# EAGLE design Group_01 (EAGLE 9.6.2)

## Sheet 1 of 2
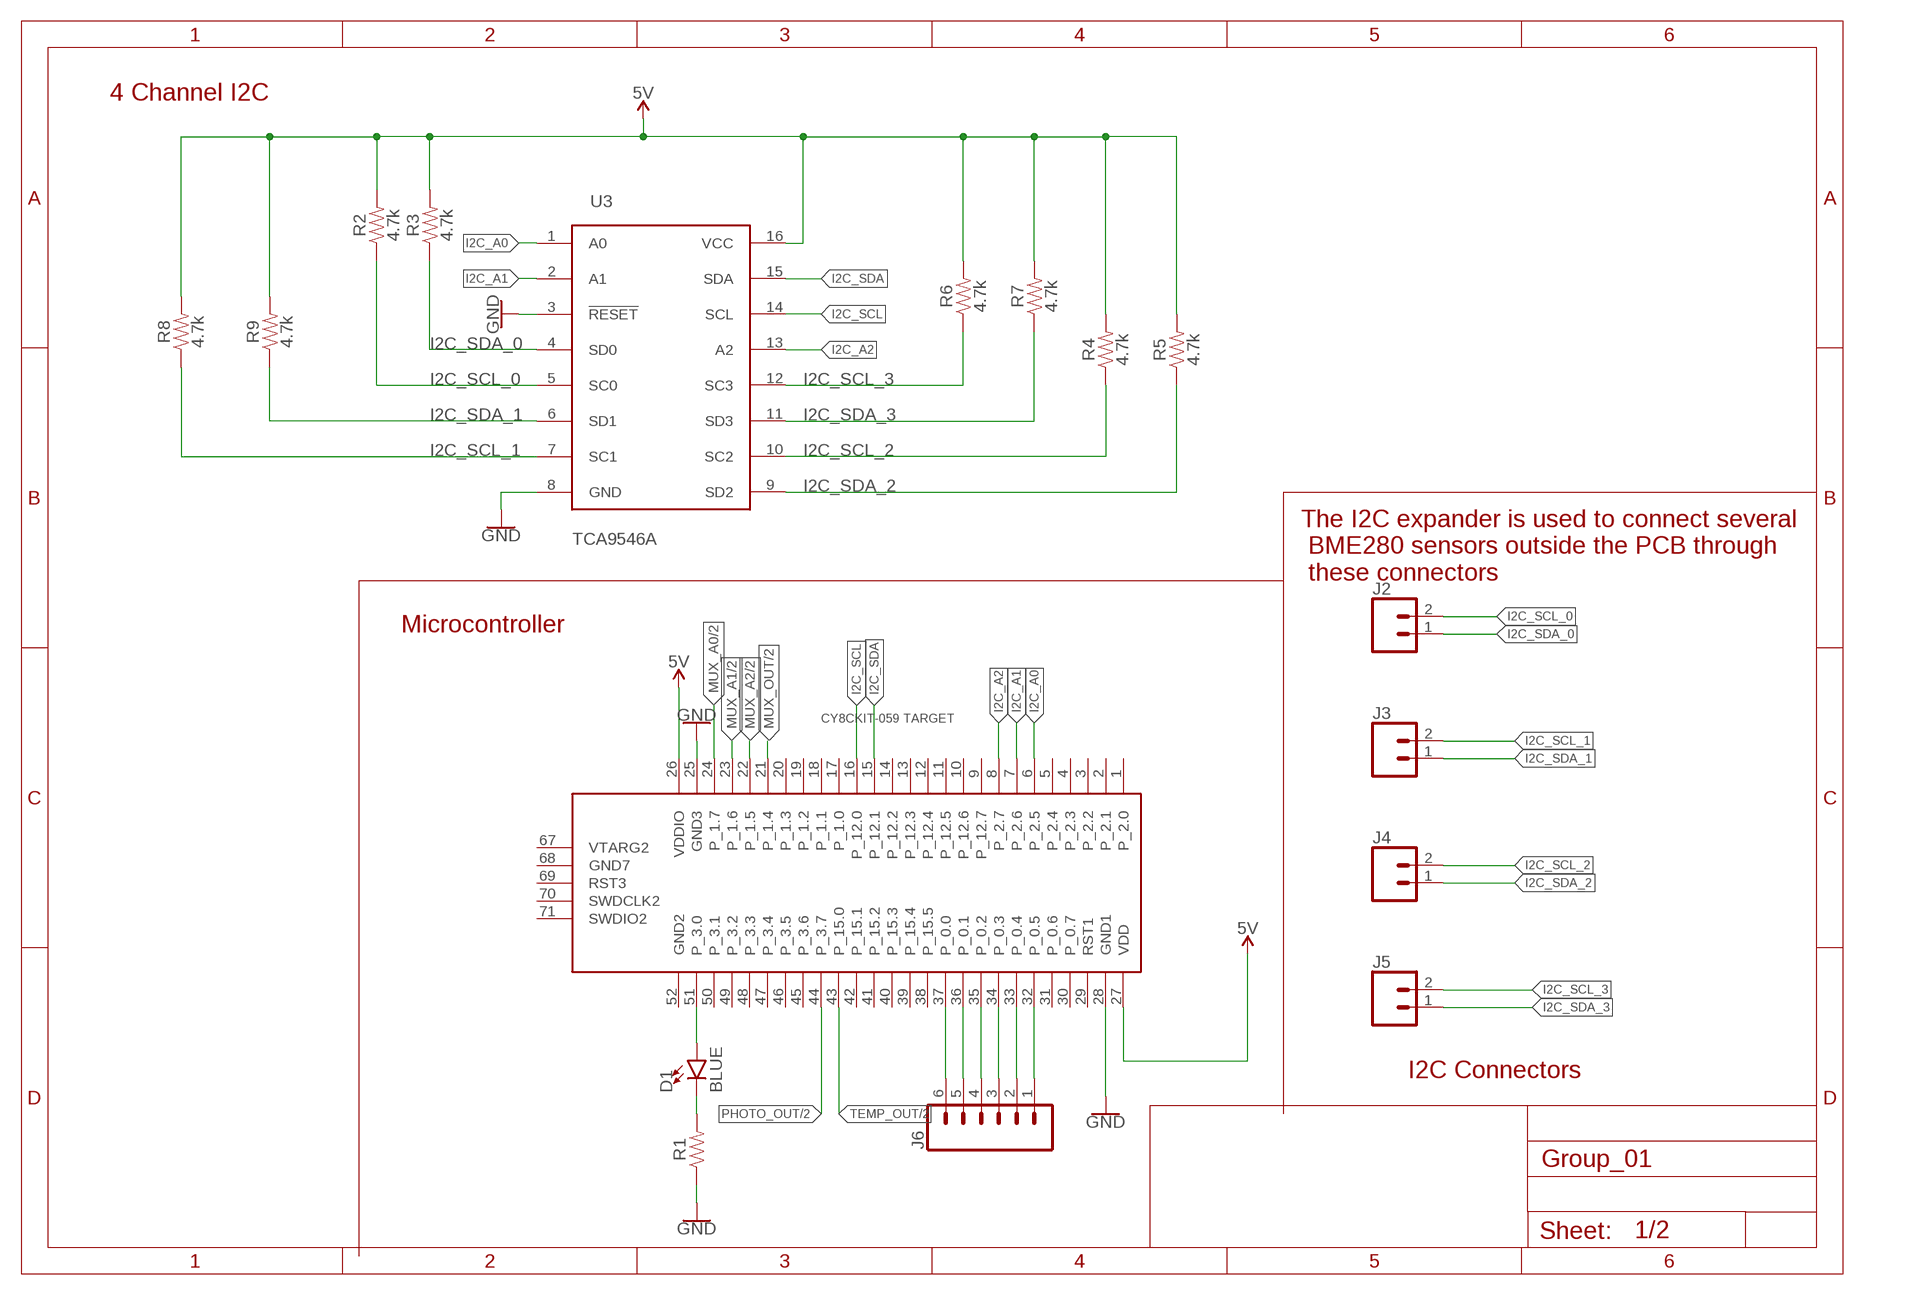
[diagram p0: schematic, sheet 1]

### Parts
D1  BLUE  LED-BLUE1206  [LED-1206]
J2  CONN_02  [1X02]
J3  CONN_02  [1X02]
J4  CONN_02  [1X02]
J5  CONN_02  [1X02]
J6  CONN_06LOCK  [1X06_LOCK]
R1  RESISTORAXIAL-0.3  [AXIAL-0.3]
R2  4.7k  4.7KOHM-0603-1/10W-1%  [0603]
R3  4.7k  4.7KOHM-0603-1/10W-1%  [0603]
R4  4.7k  4.7KOHM-0603-1/10W-1%  [0603]
R5  4.7k  4.7KOHM-0603-1/10W-1%  [0603]
R6  4.7k  4.7KOHM-0603-1/10W-1%  [0603]
R7  4.7k  4.7KOHM-0603-1/10W-1%  [0603]
R8  4.7k  4.7KOHM-0603-1/10W-1%  [0603]
R9  4.7k  4.7KOHM-0603-1/10W-1%  [0603]
U3  TCA9546A  [TSSOP16]
U$2  CY8CKIT-059_TARGET  [CY8CKIT-059_TARGET]

### Nets
5V: R2.2 R3.2 R4.2 R5.2 R6.2 R7.2 R8.2 R9.2 U3.16(VCC) U$2.26(VDDIO) U$2.27(VDD) ; also sheet 2
GND: R1.P$1 U3.3(!RESET!) U3.8(GND) U$2.25(GND3) U$2.28(GND1) ; also sheet 2
I2C_A0: U3.1(A0) U$2.6(P_2.5)
I2C_A1: U3.2(A1) U$2.7(P_2.6)
I2C_A2: U3.13(A2) U$2.8(P_2.7)
I2C_SCL: U3.14(SCL) U$2.16(P_12.0)
I2C_SCL_0: J2.2 R2.1 U3.5(SC0)
I2C_SCL_1: J3.2 R8.1 U3.7(SC1)
I2C_SCL_2: J4.2 R4.1 U3.10(SC2)
I2C_SCL_3: J5.2 R6.1 U3.12(SC3)
I2C_SDA: U3.15(SDA) U$2.15(P_12.1)
I2C_SDA_0: J2.1 R3.1 U3.4(SD0)
I2C_SDA_1: J3.1 R9.1 U3.6(SD1)
I2C_SDA_2: J4.1 R5.1 U3.9(SD2)
I2C_SDA_3: J5.1 R7.1 U3.11(SD3)
MUX_A0: U$2.24(P_1.7) ; also sheet 2
MUX_A1: U$2.23(P_1.6) ; also sheet 2
MUX_A2: U$2.22(P_1.5) ; also sheet 2
MUX_OUT: U$2.21(P_1.4) ; also sheet 2
N$8: D1.A U$2.51(P_3.0)
N$9: D1.C R1.P$2
P_0.0: J6.6 U$2.37(P_0.0)
P_0.1: J6.5 U$2.36(P_0.1)
P_0.2: J6.4 U$2.35(P_0.2)
P_0.3: J6.3 U$2.34(P_0.3)
P_0.4: J6.2 U$2.33(P_0.4)
P_0.5: J6.1 U$2.32(P_0.5)
PHOTO_OUT: U$2.44(P_3.7) ; also sheet 2
TEMP_OUT: U$2.43(P_15.0) ; also sheet 2
Unconnected: U$2.1(P_2.0) U$2.2(P_2.1) U$2.3(P_2.2) U$2.4(P_2.3) U$2.5(P_2.4) U$2.9(P_12.7) U$2.10(P_12.6) U$2.11(P_12.5) U$2.12(P_12.4) U$2.13(P_12.3) U$2.14(P_12.2) U$2.17(P_1.0) U$2.18(P_1.1) U$2.19(P_1.2) U$2.20(P_1.3) U$2.29(RST1) U$2.30(P_0.7) U$2.31(P_0.6) U$2.38(P_15.5) U$2.39(P_15.4) U$2.40(P_15.3) U$2.41(P_15.2) U$2.42(P_15.1) U$2.45(P_3.6) U$2.46(P_3.5) U$2.47(P_3.4) U$2.48(P_3.3) U$2.49(P_3.2) U$2.50(P_3.1) U$2.52(GND2) U$2.67(VTARG2) U$2.68(GND7) U$2.69(RST3) U$2.70(SWDCLK2) U$2.71(SWDIO2)

### Notes on the sheet
- 4 Channel I2C
- The I2C expander is used to connect several
   BME280 sensors outside the PCB through
   these connectors
- Microcontroller
- I2C Connectors

## Sheet 2 of 2
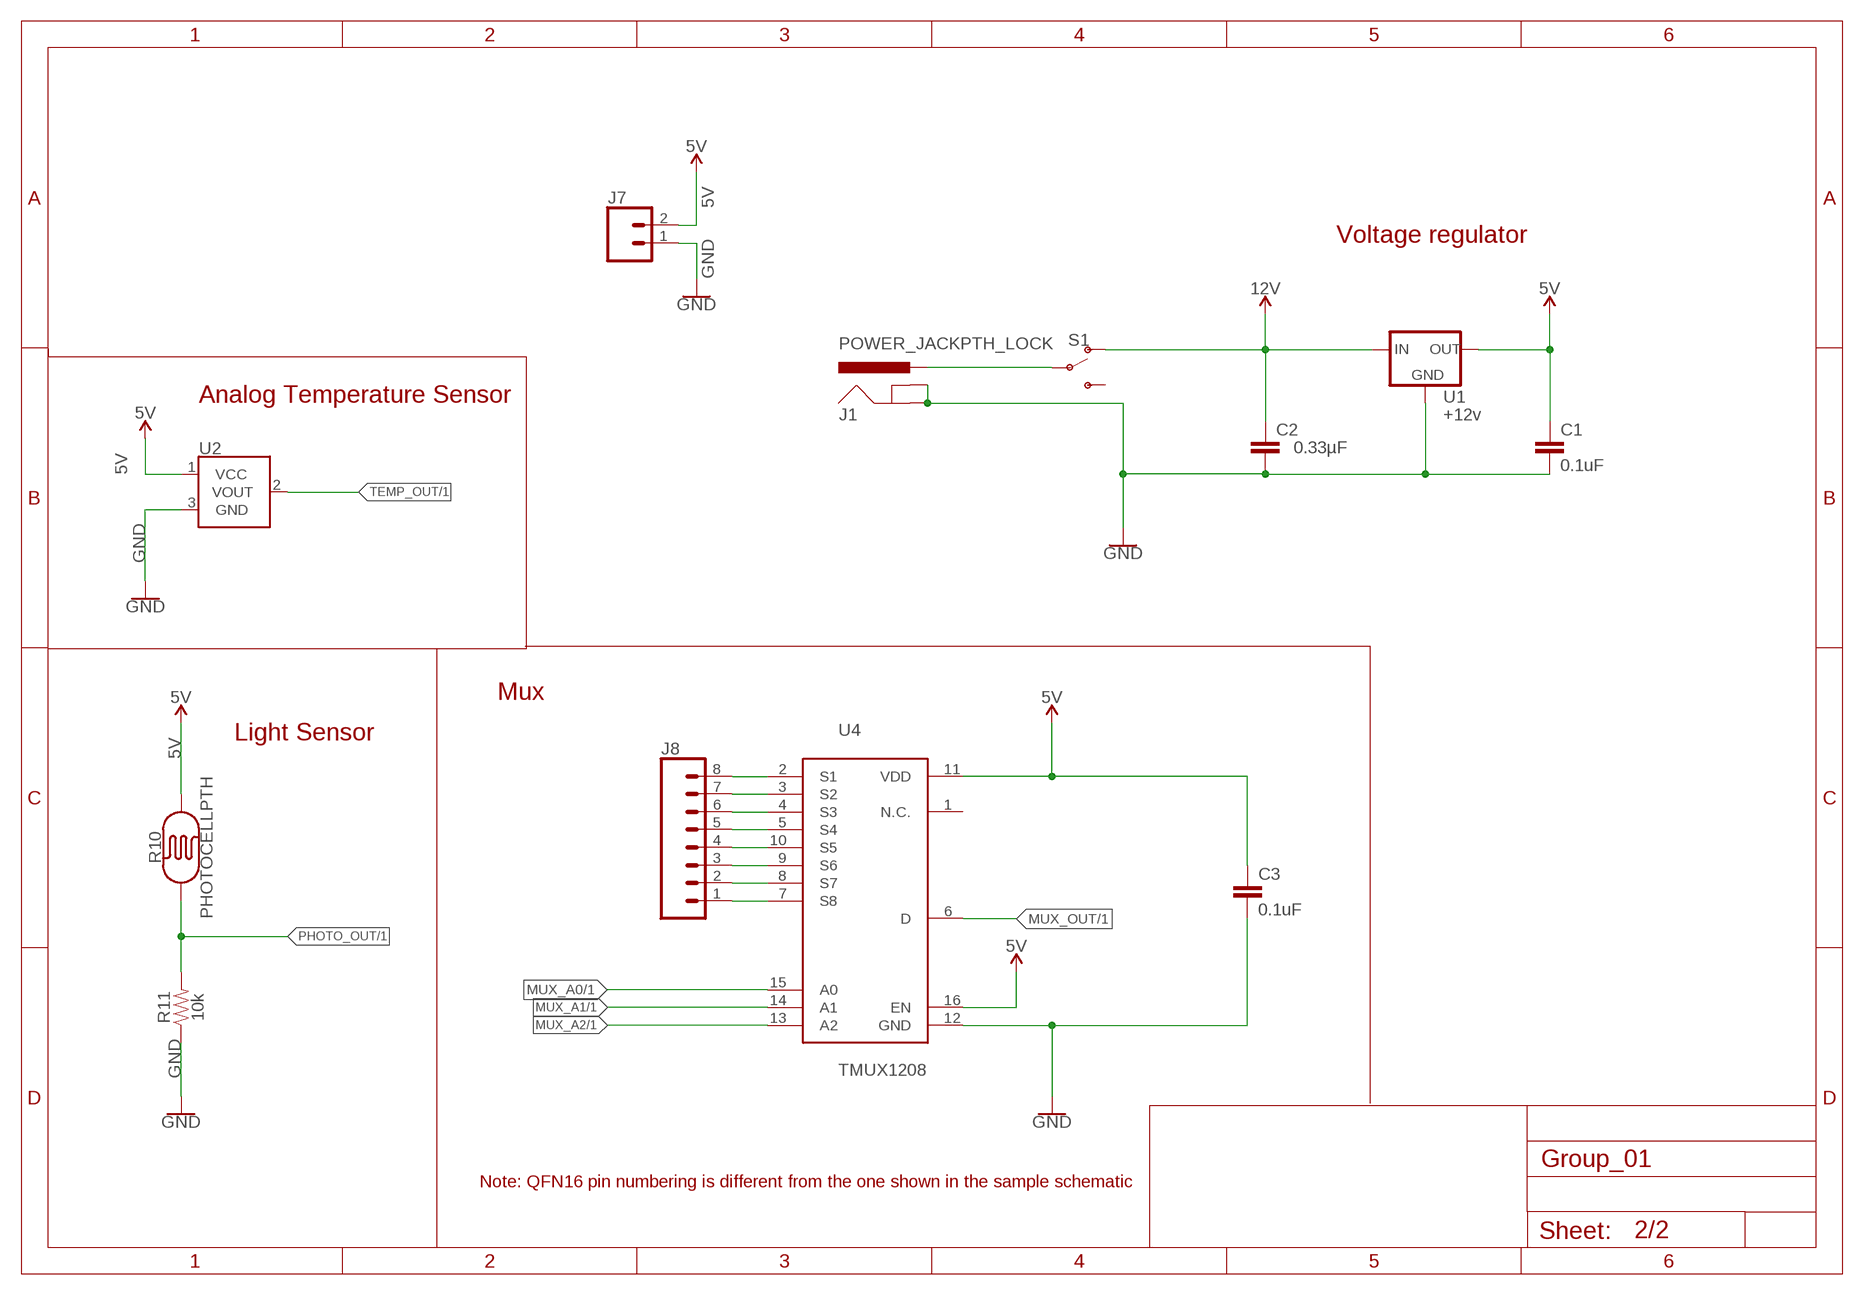
[diagram p1: schematic, sheet 2]

### Parts
C1  0.1uF  0.1UF-KIT-EZ-50V-20%  [CAP-PTH-SMALL-KIT]
C2  0.33µF  0.33UF/330NF-0805-50V-10%  [0805]
C3  0.1uF  0.1UF-KIT-EZ-50V-20%  [CAP-PTH-SMALL-KIT]
J1  POWER_JACKPTH_LOCK  [POWER_JACK_PTH_LOCK]
J7  CONN_02  [1X02]
J8  CONN_08LOCK  [1X08_LOCK]
R10  PHOTOCELLPTH  [PHOTOCELL]
R11  10k  10KOHM-0603-1/10W-1%  [0603]
S1  SWITCH-SPDT-PTH-11.6X4.0MM  [SWITCH_SPDT_PTH_11.6X4.0MM]
U1  +12v  V_REG_78XX7812  [TO-252]
U2  TMP36GT9  [TO-92]
U4  TMUX1208  [QFN16]

### Nets
5V: C1.1 C3.1 J7.2 R10.2 U1.2(OUT) U2.1(VCC) U4.11(VDD) U4.16(EN) ; also sheet 1
12V: C2.1 S1.1(O) U1.1(IN)
GND: C1.2 C2.2 C3.2 J1.GND J1.GNDBREAK J7.1 R11.1 U1.3(GND) U2.3(GND) U4.12(GND) ; also sheet 1
MUX_A0: U4.15(A0) ; also sheet 1
MUX_A1: U4.14(A1) ; also sheet 1
MUX_A2: U4.13(A2) ; also sheet 1
MUX_OUT: U4.6(D) ; also sheet 1
PHOTO_OUT: R10.1 R11.2 ; also sheet 1
S1: J8.8 U4.2(S1)
S2: J8.7 U4.3(S2)
S3: J8.6 U4.4(S3)
S4: J8.5 U4.5(S4)
S5: J8.4 U4.10(S5)
S6: J8.3 U4.9(S6)
S7: J8.2 U4.8(S7)
S8: J8.1 U4.7(S8)
SWITCH: J1.PWR S1.2(P)
TEMP_OUT: U2.2(VOUT) ; also sheet 1
Unconnected: S1.3(S) U4.1(N.C.)

### Notes on the sheet
- Voltage regulator
- Analog Temperature Sensor
- Mux
- Light Sensor
- Note: QFN16 pin numbering is different from the one shown in the sample schematic

## Library data of the parts
C1 C3 = SparkFun-Capacitors:0.1UF: 0.1µF ceramic capacitors A capacitor is a passive two-terminal electrical component used to store electrical energy temporarily in an electric field.; PROD_ID: CAP-08370
C2 = SparkFun-Capacitors:0.33UF/330NF: 0.33µF/330nF ceramic capacitors A capacitor is a passive two-terminal electrical component used to store electrical energy temporarily in an electric field.; PROD_ID: CAP-08469
D1 = SparkFun-LED:LED-BLUE: Blue SMD LED Used in manufacturing of various products at SparkFun Packages: 0603 - SMD 0603 package [Product Link] <http://www.digikey.com/product-detail/en/SMLE12BC7TT86/511-1589-2-ND/1641808> 1206 - SMD1206 package [Product Link] <http://www.digikey.com/product-detail/en/lite-on-inc/LTST-C150TBKT/160-1643-1-ND/573584> SparkFun Products: ESP8266 Thing-Dev Board <https://www.sparkfun.com/products/13711> RedBoard <https://www.sparkfun.com/products/12757>; PROD_ID: DIO-09911
J1 = SparkFun-Connectors:POWER_JACK: Power Jack Connector This is the standard 5.5mm barrel jack for power. The PTH is the most common, proven, reliable, footprint. The Slot footprint only works if the mill layer is transmitted to the PCB fab house so be warned. Here are the connectors we sell at SparkFun: DC Barrel Power Jack/Connector <https://www.sparkfun.com/products/119> (PRT-00119) DC Barrel Power Jack/Connector (SMD) <https://www.sparkfun.com/products/12748> (PRT-12748) DC Barrel Jack Adapter - Breadboard Compatible <https://www.sparkfun.com/products/10811> (PRT-10811) It is used on this SparkFun product (and many, many others): SparkFun RedBoard - Programmed with Arduino <https://www.sparkfun.com/products/12757> (DEV-12757) Also, if you need a mating power supply or connector, please check these out: Wall Adapter Power Supply - 9VDC 650mA <https://www.sparkfun.com/products/298> (TOL-00298) DC Barrel Jack Adapter - Male <https://www.sparkfun.com/products/10287> (PRT-10287); PROD_ID: CONN-08197; SF_ID: PRT-00119
J2-J5 J7 = SparkFun-Connectors:CONN_02: Multi connection point. Often used as Generic Header-pin footprint for 0.1 inch spaced/style header connections On any of the 0.1 inch spaced packages, you can populate with these: Break Away Headers - Straight <https://www.sparkfun.com/products/116> (PRT-00116) Break Away Male Headers - Right Angle <https://www.sparkfun.com/products/553> (PRT-00553) Female Headers <https://www.sparkfun.com/products/115> (PRT-00115) Break Away Headers - Machine Pin <https://www.sparkfun.com/products/117> (PRT-00117) Break Away Female Headers - Swiss Machine Pin <https://www.sparkfun.com/products/743> (PRT-00743) For SCREWTERMINALS and SPRING TERMINALS visit here: Screw Terimnals on SparkFun.com <https://www.sparkfun.com/search/results?term=Screw+Terminals> (5mm/3.5mm/2.54mm spacing) This device is also useful as a general connection point to wire up your design to another part of your project. Our various solder wires solder well into these plated through hole pads. Hook-Up Wire - Assortment (Stranded, 22 AWG) <https://www.sparkfun.com/products/11375> (PRT-11375) Hook-Up Wire - Assortment (Solid Core, 22 AWG) <https://www.sparkfun.com/products/11367> (PRT-11367) View the entire wire category on our website here <https://www.sparkfun.com/categories/141> Special notes: Molex polarized connector foot print use with: PRT-08233 with associated crimp pins and housings. 2.54_SCREWTERM for use with PRT-10571. 3.5mm Screw Terminal footprints for PRT-08084 5mm Screw Terminal footprints for use with PRT-08432
J6 = SparkFun-Connectors:CONN_06: Multi connection point. Often used as Generic Header-pin footprint for 0.1 inch spaced/style header connections On any of the 0.1 inch spaced packages, you can populate with these: Break Away Headers - Straight <https://www.sparkfun.com/products/116> (PRT-00116) Break Away Male Headers - Right Angle <https://www.sparkfun.com/products/553> (PRT-00553) Female Headers <https://www.sparkfun.com/products/115> (PRT-00115) Break Away Headers - Machine Pin <https://www.sparkfun.com/products/117> (PRT-00117) Break Away Female Headers - Swiss Machine Pin <https://www.sparkfun.com/products/743> (PRT-00743) Arduino Stackable Header - 6 Pin <https://www.sparkfun.com/products/9280> (PRT-09280) For SCREWTERMINALS and SPRING TERMINALS visit here: Screw Terimnals on SparkFun.com <https://www.sparkfun.com/search/results?term=Screw+Terminals> (5mm/3.5mm/2.54mm spacing) This device is also useful as a general connection point to wire up your design to another part of your project. Our various solder wires solder well into these plated through hole pads. Hook-Up Wire - Assortment (Stranded, 22 AWG) <https://www.sparkfun.com/products/11375> (PRT-11375) Hook-Up Wire - Assortment (Solid Core, 22 AWG) <https://www.sparkfun.com/products/11367> (PRT-11367) View the entire wire category on our website here <https://www.sparkfun.com/categories/141>
J8 = SparkFun-Connectors:CONN_08: Multi connection point. Often used as Generic Header-pin footprint for 0.1 inch spaced/style header connections On any of the 0.1 inch spaced packages, you can populate with these: Break Away Headers - Straight <https://www.sparkfun.com/products/116> (PRT-00116) Break Away Male Headers - Right Angle <https://www.sparkfun.com/products/553> (PRT-00553) Female Headers <https://www.sparkfun.com/products/115> (PRT-00115) Break Away Headers - Machine Pin <https://www.sparkfun.com/products/117> (PRT-00117) Break Away Female Headers - Swiss Machine Pin <https://www.sparkfun.com/products/743> (PRT-00743) Arduino Stackable Header - 8 Pin <https://www.sparkfun.com/products/9279> (PRT-09279) For SCREWTERMINALS and SPRING TERMINALS visit here: Screw Terimnals on SparkFun.com <https://www.sparkfun.com/search/results?term=Screw+Terminals> (5mm/3.5mm/2.54mm spacing) This device is also useful as a general connection point to wire up your design to another part of your project. Our various solder wires solder well into these plated through hole pads. Hook-Up Wire - Assortment (Stranded, 22 AWG) <https://www.sparkfun.com/products/11375> (PRT-11375) Hook-Up Wire - Assortment (Solid Core, 22 AWG) <https://www.sparkfun.com/products/11367> (PRT-11367) View the entire wire category on our website here <https://www.sparkfun.com/categories/141> Special notes: Molex polarized connector foot print use with SKU : PRT-08231 with associated crimp pins and housings. 1MM SMD Version SKU: PRT-10208 NOTES ON THE VARIANTS LOCK and LOCK_LONGPADS... This footprint was designed to help hold the alignment of a through-hole component (i.e. 6-pin header) while soldering it into place. You may notice that each hole has been shifted either up or down by 0.005 of an inch from it's more standard position (which is a perfectly straight line). This slight alteration caused the pins (the squares in the middle) to touch the edges of the holes. Because they are alternating, it causes a "brace" to hold the component in place. 0.005 has proven to be the perfect amount of "off-center" position when using our standard breakaway headers. Although looks a little odd when you look at the bare footprint, once you have a header in there, the alteration is very hard to notice. Also,if you push a header all the way into place, it is covered up entirely on the bottom side.
R1 = SparkFun-Resistors:RESISTOR: Generic Resistor Package
R2-R9 = SparkFun-Resistors:4.7KOHM: 4.7kΩ resistor A resistor is a passive two-terminal electrical component that implements electrical resistance as a circuit element. Resistors act to reduce current flow, and, at the same time, act to lower voltage levels within circuits. - Wikipedia; PROD_ID: RES-07857
R10 = SparkFun-Sensors:PHOTOCELL: Photocell (Photodetector, Photo Resistor, CdS) This is a very small light sensor. A photocell changes (also called a photodetector, photo resistor, CdS or photoconductive cell) resistance depending on the amount of light it is exposed to. These little sensors make great ambient light triggers (when light in the room turns on, do something). Datasheet <http://cdn.sparkfun.com/datasheets/Sensors/LightImaging/SEN-09088.pdf> SparkFun Products Mini Photocell <https://www.sparkfun.com/products/9088> (SEN-09088); PROD_ID: COMP-09129; SF_ID: SEN-09088
R11 = SparkFun-Resistors:10KOHM: 10kΩ resistor A resistor is a passive two-terminal electrical component that implements electrical resistance as a circuit element. Resistors act to reduce current flow, and, at the same time, act to lower voltage levels within circuits. - Wikipedia; PROD_ID: RES-00824
S1 = SparkFun-Switches:SWITCH-SPDT: Single Pole, Double Throw (SPDT) Switch Single-pole, double-throw (SPDT) switch. Variant Overview SMD-AYZ0202 Surface Mount DPDT Switch <https://www.sparkfun.com/products/597> (COM-00597) Used on e.g. LilyPad Arduino USB - ATmega32U4 Board <https://www.sparkfun.com/products/12049> PTH-11.6X4.0MM SPDT Mini Power Switch <https://www.sparkfun.com/products/102> (COM-00102) Used on e.g. SparkFun Simon Says - Through-Hole Soldering Kit <https://www.sparkfun.com/products/10547> (KIT-10547) PTH-11.6X4.0MM-KIT KIT version of SPDT Mini Power Switch - Simplifies soldering by removing tStop of switch pins - only one side can be soldered. PTH-11.6X4.0MM-LOCK LOCK version of SPDT Mini Power Switch - Offset pins hold switch in place for easier soldering. SMD-RIGHT-ANGLE Surface Mount Right Angle Switch <https://www.sparkfun.com/products/10860> (COM-10860) Used on e.g. SparkFun ESP8266 Thing <https://www.sparkfun.com/products/13231>; PROD_ID: SWCH-08261; SF_SKU: COM-00102
U1 = SparkFun-IC-Power:V_REG_78XX: Voltage Regulator Standard 78xx regulator. IGO (Input Ground Output). Spark Fun Electronics SKU : COM-00107; PROD_ID: VREG-12370
U2 = SparkFun-Sensors:TMP36: TMP36 Precision Analog °C Temperature Sensor The TMP36 is a low voltage, precision centigrade temperature sensor. It provides a voltage output that is linearly proportional to the Celsius temperature. It also doesn’t require any external calibration to provide typical accuracies of ±1°C at +25°C and ±2°C over the −40°C to +125°C temperature range. We like it because it’s so easy to use: Just give the device a ground and 2.7 to 5.5 VDC and read the voltage on the Vout pin. The output voltage can be converted to temperature easily using the scale factor of 10 mV/°C. Datasheet <http://cdn.sparkfun.com/datasheets/Sensors/Temp/TMP35_36_37.pdf> SparkFun Products Temperature Sensor - TMP36 <https://www.sparkfun.com/products/10988> (SEN-10988) SparkFun Danger Shield <https://www.sparkfun.com/products/11649> (DEV-11649); PROD_ID: IC-09880; SF_ID: SEN-10988
U3 = Group_01_Library:TCA9546A: TCA9546A The TCA9546A is a quad bidirectional translating switch controlled via the I2C bus. The SCL/SDA upstream pair fans out to four downstream pairs,or channels. Anyindividual SCn/SDn channel or combination of channels can be selected, determined by the contents of the programmable control register. For the full datasheet follow the link <https://www.ti.com/lit/ds/symlink/tca9546a.pdf?ts=1615833311153&ref_url=https%253A%252F%252Fwww.ti.com%252Fproduct%252FTCA9546A%253FHQS%253DTI-null-null-octopart-df-pf-null-wwe>.
U4 = Group_01_Library:TMUX1208: TMUX1208 The TMUX1208 and TMUX1209 are general purpose complementary metal-oxide semiconductor (CMOS) multiplexers (MUX). The TMUX1208 offers 8:1 singleended channels, while the TMUX1209 offers differential 4:1 or dual 4:1 single-ended channels. Wide operating supply of 1.08 V to 5.5 V allows for use in a broad array of applications from personal electronics to building automation applications. The device supports bidirectional analog and digital signals on the source (Sx) and drain (D) pins ranging from GND to VDD. For the full datasheet follow the link <https://www.ti.com/lit/ds/symlink/tmux1208.pdf?ts=1615825592091>.
U$2 = CY8KIT-059:CY8CKIT-059_TARGET: CY8CKIT-059 Target This device exposes the pins of the target section of the CY8CKIT-059, including the programming section, that must be connected to the KitProg in order to program the target micro-controller.

## Board
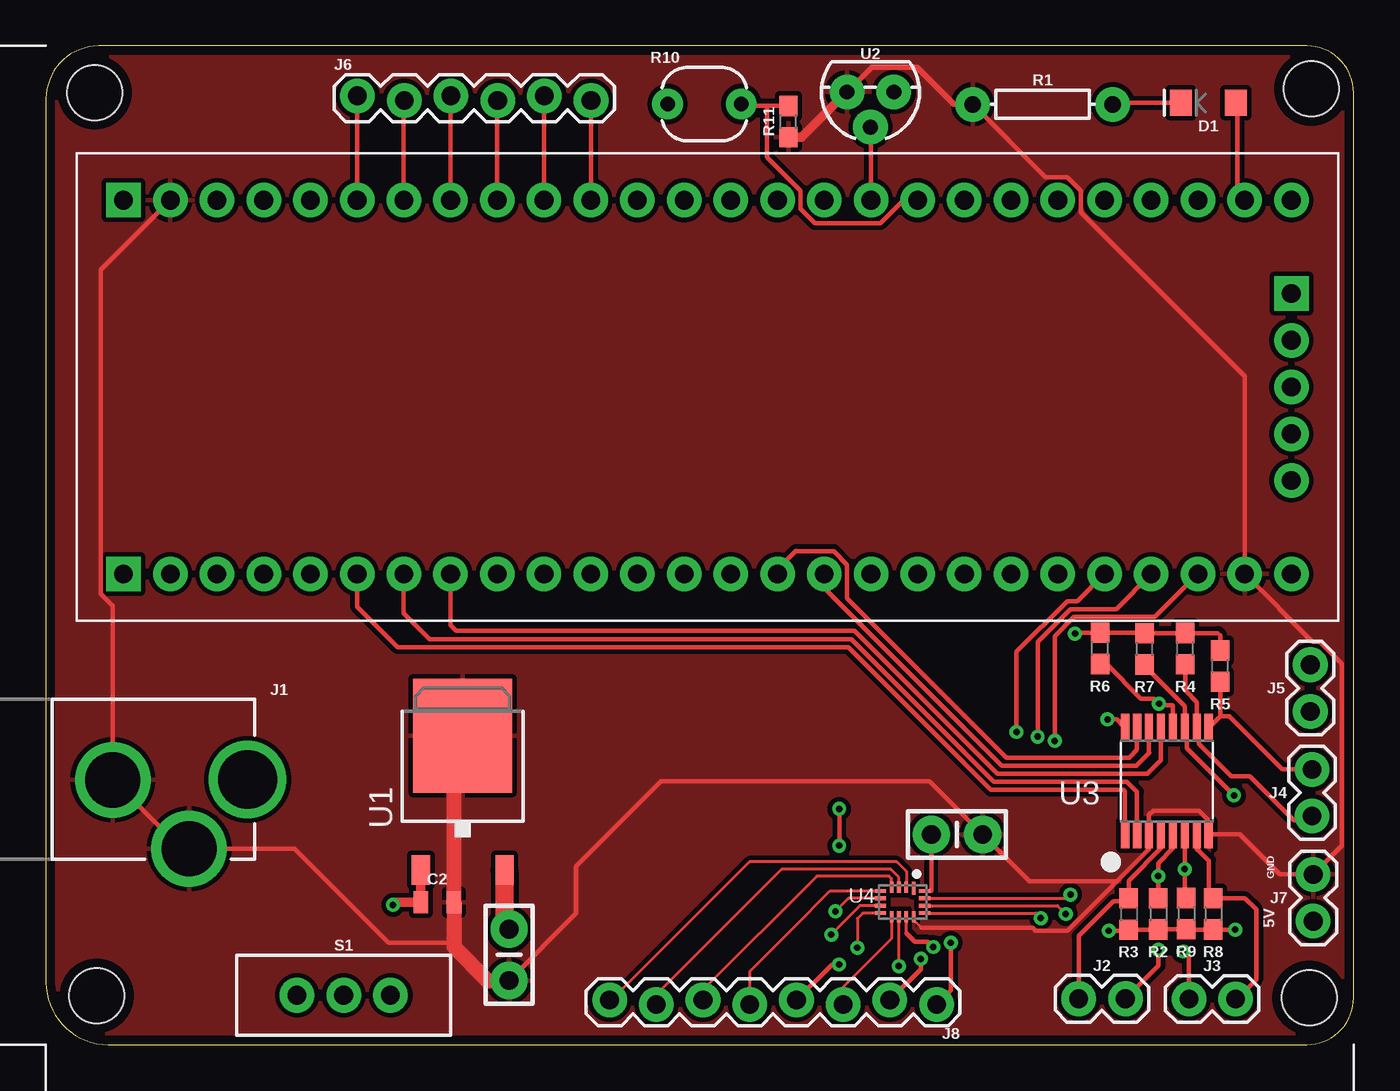
[diagram p2: board, top side]
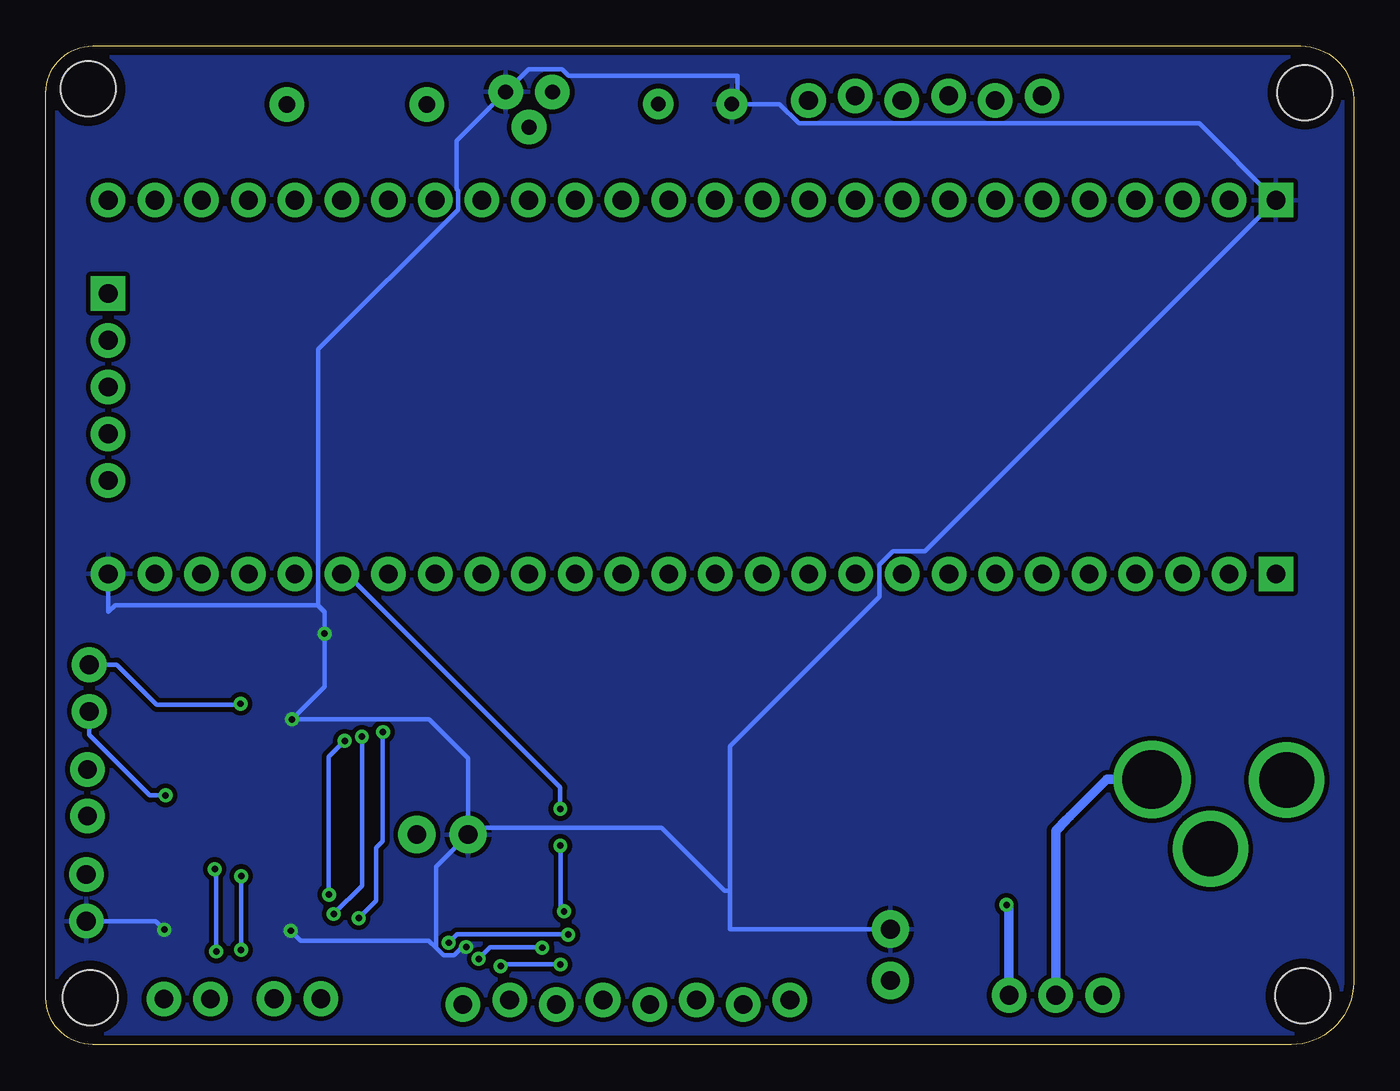
[diagram p3: board, bottom side, seen from below]

Size 71.1 x 54.28 mm. Coordinates in mm from the lower left corner, seen from the top.
Outline: 68.56,54.28 2.87,54.28 arc90 0,51.41 0,3.39 arc90 3.39,0 68.56,0 arc90 71.1,2.54 71.1,51.74 arc90 68.56,54.28
Copper layers (1*16): Top 0.035mm / dielectric 1.5mm / Bottom 0.035mm
Design rules "Group_01": minimum track width 10mil, minimum drill 0.35mm, track to track 7mil, track to pad 7mil, pad to pad 7mil, via to via 7mil, smd to smd 7mil, copper to edge 20mil, drill to drill 7mil, minimum pad ring 10mil, minimum via ring 8mil, stop-mask expansion 10mil, vias tented up to drill 0mil, thermal gap 10mil
Holes 3 mm at 2.65,51.75 68.8,51.95 2.75,2.65 68.7,2.55

### Footprints (pad centres in the part's own frame; a part is rotated, then mirrored left to right if it is on the bottom)
CAP-PTH-SMALL-KIT = drill 1.016 pad 2.032: 1 -1.397,0; 2 1.397,0
0805 = smd 0.8 x 1.2: 1 -0.9,0; 2 0.9,0
LED-1206 = smd 1.2 x 1.4: A -1.5,0; C 1.5,0
POWER_JACK_PTH_LOCK = drill 2.997 pad 4.115: GND 0.025,6.557; GNDBREAK 3.762,10.7 | drill 3.2 pad 4.115: PWR 0,13.878
1X02 = drill 1.016 pad 1.88: 1 0,0; 2 2.54,0
1X06_LOCK = drill 1.016 pad 1.88: 1 0,0; 2 2.54,-0.254; 3 5.08,0; 4 7.62,-0.254; 5 10.16,0; 6 12.7,-0.254
1X08_LOCK = drill 1.016 pad 1.88: 1 0,0.127; 2 2.54,-0.127; 3 5.08,0.127; 4 7.62,-0.127; 5 10.16,0.127; 6 12.7,-0.127; 7 15.24,0.127; 8 17.78,-0.127
AXIAL-0.3 = drill 0.9 pad 1.88: P$1 -3.81,0; P$2 3.81,0
0603 = smd 1.1 x 1: 1 -0.85,0; 2 0.85,0
PHOTOCELL = drill 0.8 pad 1.676: 1 -2,0; 2 2,0
SWITCH_SPDT_PTH_11.6X4.0MM = drill 1.016 pad 1.88: 1 0,2.54; 2 0,0; 3 0,-2.54
TO-252 = smd 1 x 1.6: 1 -2.28,-4.8; 2 2.28,-4.8 | smd 5.4 x 6.2: 3 0,2.5
TO-92 = drill 0.813 pad 1.88: 1 -1.27,0; 2 0,1.905; 3 1.27,0
TSSOP16 = smd 1.5 x 0.45: 1 -2.9,2.275; 2 -2.9,1.625; 3 -2.9,0.975; 4 -2.9,0.325; 5 -2.9,-0.325; 6 -2.9,-0.975; 7 -2.9,-1.625; 8 -2.9,-2.275; 9 2.9,-2.275; 10 2.9,-1.625; 11 2.9,-0.975; 12 2.9,-0.325; 13 2.9,0.325; 14 2.9,0.975; 15 2.9,1.625; 16 2.9,2.275
QFN16 = smd 0.7 x 0.2: 1 -0.75,0.6 | smd 0.6 x 0.2: 2 -0.8,0.2; 3 -0.8,-0.2; 4 -0.8,-0.6; 9 0.8,-0.6; 10 0.8,-0.2; 11 0.8,0.2; 12 0.8,0.6 | smd 0.2 x 0.6: 5 -0.6,-1.2; 6 -0.2,-1.2; 7 0.2,-1.2; 8 0.6,-1.2; 13 0.6,1.2; 14 0.2,1.2; 15 -0.2,1.2; 16 -0.6,1.2
CY8CKIT-059_TARGET = drill 1.016 pad 1.876 square: 1 30.48,8.89; 27 30.48,-11.43; 71 -33.02,-6.35 | drill 1.016 pad 1.876: 2 27.94,8.89; 3 25.4,8.89; 4 22.86,8.89; 5 20.32,8.89; 6 17.78,8.89; 7 15.24,8.89; 8 12.7,8.89; 9 10.16,8.89; 10 7.62,8.89; 11 5.08,8.89; 12 2.54,8.89; 13 0,8.89; 14 -2.54,8.89; 15 -5.08,8.89; 16 -7.62,8.89; 17 -10.16,8.89; 18 -12.7,8.89; 19 -15.24,8.89; 20 -17.78,8.89; 21 -20.32,8.89; 22 -22.86,8.89; 23 -25.4,8.89; 24 -27.94,8.89; 25 -30.48,8.89; 26 -33.02,8.89; 28 27.94,-11.43; 29 25.4,-11.43; 30 22.86,-11.43; 31 20.32,-11.43; 32 17.78,-11.43; 33 15.24,-11.43; 34 12.7,-11.43; 35 10.16,-11.43; 36 7.62,-11.43; 37 5.08,-11.43; 38 2.54,-11.43; 39 0,-11.43; 40 -2.54,-11.43; 41 -5.08,-11.43; 42 -7.62,-11.43; 43 -10.16,-11.43; 44 -12.7,-11.43; 45 -15.24,-11.43; 46 -17.78,-11.43; 47 -20.32,-11.43; 48 -22.86,-11.43; 49 -25.4,-11.43; 50 -27.94,-11.43; 51 -30.48,-11.43; 52 -33.02,-11.43; 67 -33.02,3.81; 68 -33.02,1.27; 69 -33.02,-1.27; 70 -33.02,-3.81

### Placement (x,y rotation side)
C1  25.18,4.87 270 top
C2  21.28,7.75 0 top
C3  49.54,11.41 0 top
D1  63.21,51.19 180 top
J1  -2.92,14.41 270 top
J2  56.16,2.49 0 top
J3  62.15,2.48 0 top
J4  68.85,14.96 270 top
J5  68.75,18.11 90 top
J6  16.94,51.57 0 top
J7  68.91,9.25 270 top
J8  48.43,2.3 180 top
R1  54.2,51.11 0 top
R2  60.48,7.1 270 top
R3  58.87,7.1 270 top
R4  61.95,21.52 90 top
R5  63.85,20.57 90 top
R6  57.32,21.54 90 top
R7  59.74,21.51 90 top
R8  63.47,7.1 270 top
R9  62,7.12 270 top
R10  35.8,51.12 180 top
R11  40.37,50.17 90 top
S1  16.19,2.68 270 top
U1  22.66,14.29 0 top
U2  44.83,51.78 180 top
U3  60.95,14.32 90 top
U4  46.58,7.75 270 top
U$2  34.7,34.47 180 top

### Tracks (layer width: path | path; a pad name or v marks a point on that pad's centre or on a via)
5V  (via drill 0.35)
  Top 0.152: U4.16 48.15,8.35 | 46.78,6.06 U4.11
  Top 0.254: R4.2 59.86,22.37 | 59.86,22.37 59.6,22.37 59.38,22.15 59.53,22.15 R7.2 61.93,22.36 R4.2 | R5.2 63.85,22.25 63.73,22.37 R4.2 | 59.86,22.37 59.84,22.39 R6.2 56.01,22.39 v55.95,22.34 | 48.15,8.35 C3.1 | v48.25,5.3 47.97,5.58 47.26,5.58 46.78,6.06 | v57.72,17.68 58.22,17.68 U3.16 | v57.78,6.19 58.81,6.19 R3.2 R2.2 60.5,6.27 R9.2 62.02,6.25 R8.2 v64.66,6.25
  Top 1.016: C1.1 24.93,6.52 U1.2
  Bottom 0.254: C1.1 33.9,6.27 33.9,8.36 | 33.9,8.36 34.2,8.36 37.62,11.78 47.78,11.78 C3.1 | v64.66,6.25 65.12,6.71 J7.2 | 49.88,5.25 49.48,4.85 48.91,4.85 48.46,5.3 v48.25,5.3 | C3.1 49.88,9.68 49.88,5.25 | C3.1 48.15,15.56 50.26,17.68 v57.72,17.68 55.95,19.44 v55.95,22.34 | v55.95,22.34 55.95,23.54 56.3,23.88 56.3,37.78 48.7,45.38 48.7,46.41 48.76,46.48 48.76,49.12 U2.1 44.85,53.02 43.04,53.02 42.69,52.67 33.49,52.67 33.49,51.43 R10.2 31.2,51.12 30.16,50.07 8.39,50.07 U$2.27 23.3,26.82 25.05,26.82 25.78,26.09 25.78,24.34 33.9,16.22 33.9,8.36 | v55.95,22.34 55.95,23.51 56.34,23.89 67.35,23.89 67.72,23.52 U$2.26 | 49.88,5.25 50.28,5.66 57.25,5.66 v57.78,6.19
  pour Bottom (isolate 0.254): 0.19,50.98 0.19,3.92 arc90 3.96,0.14 67.56,0.14 arc90 70.95,3.52 70.95,50.96 arc90 67.81,54.09 3.3,54.09 arc90
12V  (via drill 0.35)
  Top 0.508: v18.87,7.59 19.02,7.75 C2.1 U1.1
  Bottom 0.508: S1.1 18.73,7.45 v18.87,7.59
GND
  Top 0.152: U4.12 47.18,6.78 47.61,6.35
  Top 0.254: 58.23,8.88 59.98,10.62 U3.3 59.98,12.49 60.2,12.72 62.69,12.72 63.19,12.23 63.19,11.46 U3.8 64.92,11.42 67.09,9.25 J7.1 70.46,10.8 70.46,20.7 69.27,21.89 68.87,21.89 U$2.25 65.18,36.32 56.26,45.24 56.26,46.41 55.53,47.14 54.36,47.14 R1.P$1 | C1.2 28.83,7.13 28.83,9.69 33.46,14.31 48.04,14.31 C3.2 53.47,8.88 58.23,8.88 | 22.18,5.82 21.9,5.54 18.63,5.54 13.52,10.65 J1.GNDBREAK 7.37,10.65 J1.GND 3.64,23.86 2.98,24.52 2.98,42.12 U$2.28 | 47.61,6.35 53.65,6.35 53.81,6.19 55.54,6.19 58.23,8.88
  Top 0.305: R1.P$1 49.38,51.11 47.35,53.14 44.92,53.14 U2.3
  Top 0.508: R11.1 41.09,49.32 43.55,51.78 U2.3
  Top 0.813: U1.3 22.63,16.82 22.55,16.82 22.18,16.45 C2.2 22.18,5.82 22.18,5.32 24.02,3.48 C1.2
  pour Top (isolate 0.254): 67.78,54.11 3.34,54.11 arc90 0.18,50.95 0.18,3.93 arc90 3.94,0.16 67.55,0.16 arc90 70.95,3.57 70.95,50.93 arc90
I2C_A0
  Top 0.254: U3.1 58.67,13.77 58.58,13.86 51.37,13.86 43.63,21.6 19.13,21.6 16.92,23.81 U$2.6
I2C_A1
  Top 0.254: U3.2 59.33,13.73 58.76,14.29 51.55,14.29 43.81,22.03 20.86,22.03 19.46,23.44 U$2.7
I2C_A2
  Top 0.254: U3.13 60.62,15.46 59.89,14.72 51.73,14.72 43.96,22.49 22.31,22.49 22,22.8 U$2.8
I2C_SCL
  Top 0.254: U3.14 59.98,15.87 59.99,15.86 59.29,15.16 51.97,15.16 42.32,24.8 U$2.16
I2C_SCL_0  (via drill 0.35)
  Top 0.254: R2.1 v60.48,9.16 60.48,9.87 61.27,10.66 U3.5 | v60.49,5.14 60.49,4.29 J2.2
  Bottom 0.254: v60.48,9.16 60.48,6.27 60.48,5.17 60.49,5.16 v60.49,5.14
I2C_SCL_1
  Top 0.254: J3.2 64.75,2.49 65.8,3.54 65.8,7.34 65.2,7.95 R8.1 63.23,8.19 63.23,10.01 62.67,10.57 62.62,10.57 62.58,10.62 U3.7
I2C_SCL_2
  Top 0.254: R4.1 61.95,19.25 62.58,18.62 U3.10 62.7,17.1 62.7,16.34 64.46,14.58 65.47,14.58 67.86,12.18 68.61,12.18 J4.2
I2C_SCL_3  (via drill 0.35)
  Top 0.254: U3.12 61.27,18.43 61.26,18.44 60.66,18.44 60.57,18.53 v60.52,18.53 60.24,18.8 59.55,18.8 57.66,20.69 R6.1
  Bottom 0.254: J5.2 67.25,20.65 65.07,18.46 60.58,18.46 v60.52,18.53
I2C_SDA
  Top 0.254: U$2.15 39.78,25.84 40.79,26.84 40.81,26.82 42.84,26.82 43.56,26.09 43.56,24.26 52.23,15.6 58.91,15.6 59.33,16.02 U3.15
I2C_SDA_0
  Top 0.254: U3.4 60.62,10.66 58.87,8.91 R3.1 58.72,7.8 58.05,7.8 56.16,5.9 J2.1
I2C_SDA_1  (via drill 0.35)
  Top 0.254: U3.6 v61.92,9.54 61.92,8.04 R9.1 | v61.84,5.06 62.15,4.75 J3.1
  Bottom 0.254: v61.84,5.06 61.84,9.45 v61.92,9.54
I2C_SDA_2
  Top 0.254: R5.1 63.85,17.84 | U3.9 63.85,17.84 | 63.85,17.84 64.35,17.84 67.24,14.96 J4.1
I2C_SDA_3  (via drill 0.35)
  Top 0.254: R7.1 59.74,20.57 61.93,18.38 61.93,17.3 | U3.11 61.93,17.3 | v64.6,13.54 62.05,16.1 62.05,16.54 61.88,16.7 61.88,17.25 61.93,17.3
  Bottom 0.254: v64.6,13.54 65.45,13.54 68.75,16.85 J5.1
MUX_A0  (via drill 0.35)
  Top 0.152: U4.15 55.51,7.95 v55.71,8.15
  Top 0.254: U$2.24 60.3,23.24 55.89,23.24 54.86,22.2 v54.86,16.51
  Bottom 0.254: v54.86,16.51 55.72,15.65 55.72,8.16 v55.71,8.15
MUX_A1  (via drill 0.35)
  Top 0.152: U4.14 55,7.55 v55.45,7.1
  Top 0.254: U$2.23 58.19,23.67 55.72,23.67 53.93,21.89 53.93,16.74 v53.92,16.74
  Bottom 0.254: v53.92,16.74 53.92,8.63 v55.45,7.1
MUX_A2  (via drill 0.35)
  Top 0.152: U4.13 53.82,7.15 v54.09,6.87
  Top 0.254: U$2.22 56.09,24.11 55.54,24.11 52.78,21.35 v52.78,16.99
  Bottom 0.254: v54.09,6.87 53.15,7.82 53.15,10.69 52.8,11.04 52.8,16.97 v52.78,16.99
MUX_OUT  (via drill 0.35)
  Top 0.152: U4.6 43.64,7.95 v42.93,7.24
  Top 0.254: v43.13,10.81 v43.13,12.81
  Bottom 0.254: v42.93,7.24 43.12,7.43 43.12,10.48 43.13,10.49 v43.13,10.81 | v43.13,12.81 43.13,13.97 54.74,25.58 U$2.21
N$8
  Top 0.254: D1.A arc-45 64.79,50.99 64.79,46.29 U$2.51
N$9
  Top 0.254: R1.P$2 58.09,51.19 D1.C
P_0.0
  Top 0.254: J6.6 29.64,45.92 U$2.37
P_0.1
  Top 0.254: J6.5 27.08,51.55 U$2.36
P_0.2
  Top 0.254: J6.4 24.54,51.3 U$2.35
P_0.3
  Top 0.254: J6.3 22,51.55 U$2.34
P_0.4
  Top 0.254: J6.2 19.46,51.3 U$2.33
P_0.5
  Top 0.254: U$2.32 16.92,51.55 J6.1
PHOTO_OUT
  Top 0.254: R11.2 39.22,51.02 | 39.22,51.02 37.9,51.02 R10.1 | U$2.44 46.62,45.9 45.38,44.66 44.68,44.66 41.8,44.66 41.02,45.44 41.02,46.41 39.22,48.22 39.22,51.02
S1
  Top 0.152: J8.8 30.76,2.43 38.27,9.93 46.26,9.93 46.78,9.42 U4.2
S2
  Top 0.152: U4.3 46.38,9.09 45.94,9.53 39.98,9.53 33.19,2.73 J8.7
S3
  Top 0.152: U4.4 45.98,9.02 45.84,9.16 41.91,9.16 35.73,2.98 J8.6
S4
  Top 0.152: J8.5 38.27,3.98 40.64,6.35 42.64,8.35 U4.5
S5  (via drill 0.35)
  Top 0.152: v46.37,4.26 U4.10
  Top 0.254: J8.4 42.73,4.35 v43.13,4.35
  Bottom 0.254: v46.37,4.26 46.28,4.35 v43.13,4.35
S6
  Top 0.152: U4.9 45.98,5.76 43.35,3.12 J8.3
S7  (via drill 0.35)
  Top 0.152: U4.8 44.41,7.15 44.12,6.85 v44.12,5.26
  Top 0.254: v47.57,4.66 47.57,4.11 J8.2
  Bottom 0.254: v44.12,5.26 44.15,5.3 46.95,5.3 47.58,4.67 v47.57,4.66
S8  (via drill 0.35)
  Top 0.152: U4.7 44.25,7.55 42.7,6 v42.7,5.97
  Top 0.254: v49.2,5.54 49.2,2.94 J8.1
  Bottom 0.254: v42.7,5.97 42.72,5.99 48.75,5.99 v49.2,5.54
SWITCH
  Bottom 0.508: J1.PWR 13.42,14.41 15.42,12.41 15.61,12.21 16.19,11.64 S1.2
TEMP_OUT
  Top 0.254: U$2.43 44.86,49.84 U2.2

### Text on the board
tPlace: GND | 5V